# Altium schematic sheet IMU.SchDoc
size A; SheetNumber: 1; SheetTotal: 3
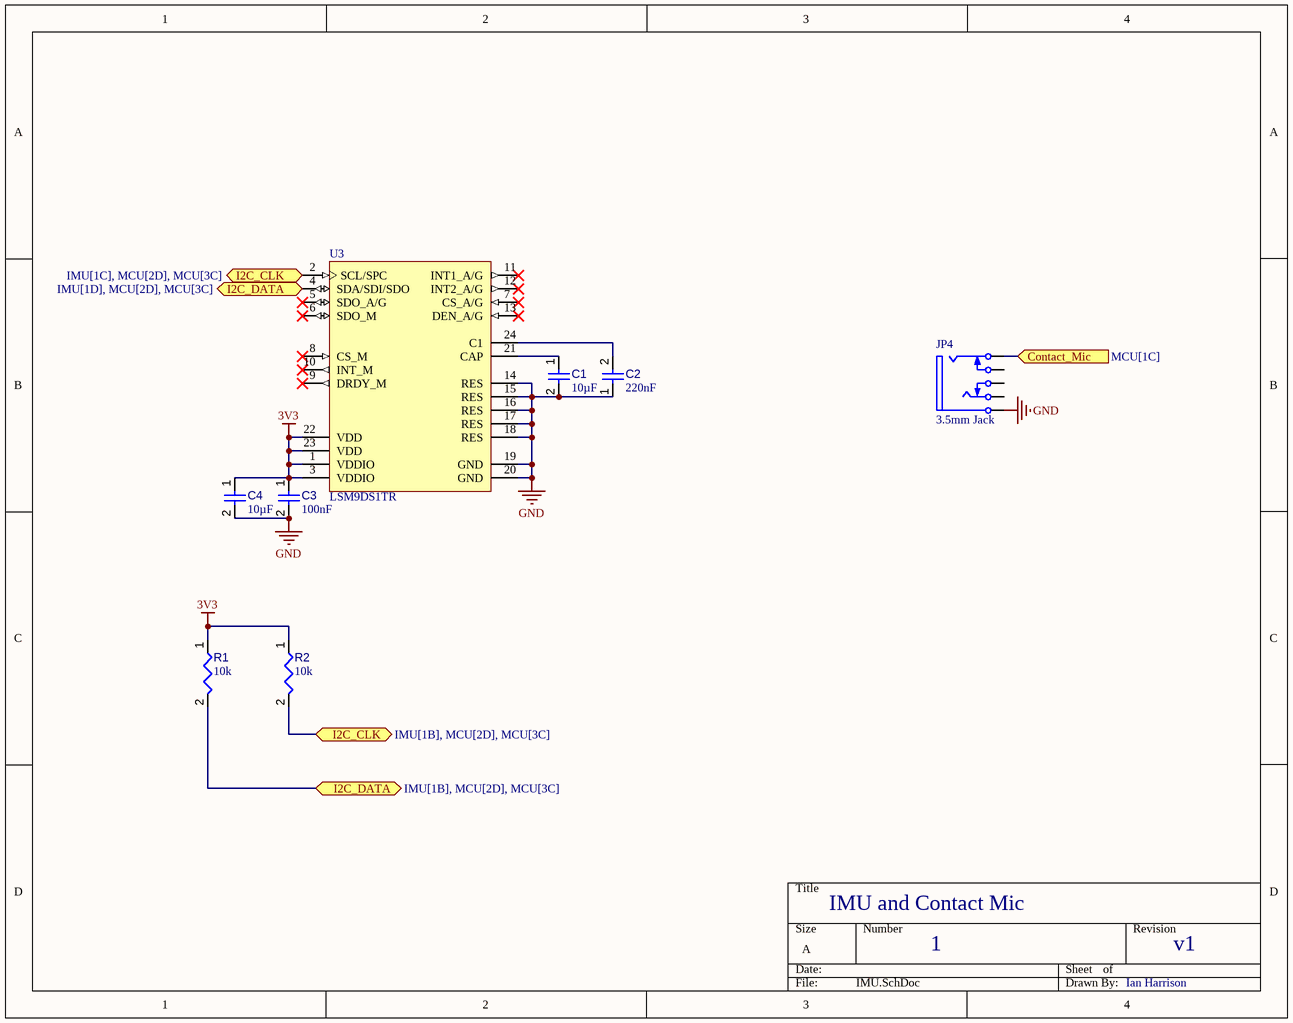
[diagram p0: IMU.SchDoc]

## Parts
C1  value 10µF  [CAPC0603(1608)100_L]  (hidden comment: Capacitor 10µF +/-20% 10V 0603)
C2  value 220nF  [FP-C0603C-CF-IPC_B]  (hidden comment: Capacitor 220 nF)
C3  value 100nF  [CAPC1608X90X40NL10T20]  (hidden comment: Capacitor 100 nF +/-10% 50 V 0603)
C4  value 10µF  [CAPC0603(1608)100_L]  (hidden comment: Capacitor 10µF +/-20% 10V 0603)
JP4  3.5mm Jack  [SWIT-35RASMT4BHNTRX_V]
R1  value 10k  [RESC1608X55X25ML10T15]  (hidden comment: Resistor 10k +/-1% 0603 100 mW)
R2  value 10k  [RESC1608X55X25ML10T15]  (hidden comment: Resistor 10k +/-1% 0603 100 mW)
U3  LSM9DS1TR  [STM-LGA-24_3500X3000X1000]

## Ports
Contact_Mic (in, see MCU[1C]), I2C_CLK (bidir, see IMU[1B], MCU[2D], MCU[3C]), I2C_CLK (bidir, see IMU[1C], MCU[2D], MCU[3C]), I2C_DATA (bidir, see IMU[1B], MCU[2D], MCU[3C]), I2C_DATA (bidir, see IMU[1D], MCU[2D], MCU[3C])

## Nets
3V3: C3.1 C4.1 R1.1 R2.1 U3.1(VDDIO) U3.3(VDDIO) U3.22(VDD) U3.23(VDD)
GND: C1.2 C2.1 C3.2 C4.2 JP4.1 U3.14(RES) U3.15(RES) U3.16(RES) U3.17(RES) U3.18(RES) U3.19(GND) U3.20(GND)
Contact_Mic: JP4.2 ; port Contact_Mic
I2C_CLK: R2.2 U3.2(SCL/SPC) ; port I2C_CLK
I2C_DATA: R1.2 U3.4(SDA/SDI/SDO) ; port I2C_DATA
NetC1_1: C1.1 U3.21(CAP)
NetC2_2: C2.2 U3.24(C1)

Not connected (* = marked no-connect by the designer): JP4 3 4 5; U3 5(SDO_A/G)* 6(SDO_M)* 7(CS_A/G)* 8(CS_M)* 9(DRDY_M)* 10(INT_M)* 11(INT1_A/G)* 12(INT2_A/G)* 13(DEN_A/G)*

## Notes on the sheet
- IMU and Contact Mic
- 1
- v1
- Ian Harrison

## Library data of the parts
C1 C4 = CMP-001-00075-4: Chip Capacitor, 10µF +/-20%, 10V, 0603, Thickness 1 mm; Tolerance: 10%; Voltage Rating: 10V; Max Operating Temperature: 85°C; Pins: 2; Case/Package: 0603; Mounting Technology: SMT; Min Operating Temperature: -55°C
C2 = CMP-001-00085-2: Ceramic Capacitor, Multilayer, Ceramic, 25V, 10% +Tol, 10% -Tol, X7R, 15% TC, 0.22uF, Surface Mount, 0603; Capacitor Type: Ceramic; Min Operating Temperature: -55°C; RoHS Compliant: Yes; Case/Package: 0603; Mounting Technology: Surface Mount; Max Operating Temperature: 125°C; Pins: 2
C3 = CMP-001-00017-7: Chip Capacitor, 100 nF, +/- 10%, 50 V, 0603 (1608 Metric); Voltage Rating: 50V; Capacitor Type: Ceramic; Tolerance: 10%; Mounting Technology: SM; Max Operating Temperature: 125°C; RoHS Compliant: True; Pins: 2; Case/Package: 0603; Min Operating Temperature: -55°C
JP4 = CMP-002-00071-1: 3 Pole(s), Surface Mount Terminal, Jack; Connector Type: AUDIO/RCA CONNECTOR; Mounting Technology: Board; RoHS Compliant: Yes
R1 R2 = CMP-009-00017-5: Chip Resistor, 10 KOhm, +/- 1%, 01 W, -55 to 155 degC, 0603 (1608 Metric); Voltage Rating: 50V; Power: 100mW; RoHS Compliant: True; Min Operating Temperature: -55°C; Pins: 2; Case/Package: 0603; Mounting Technology: SM; Max Operating Temperature: 155°C; Tolerance: 1%
U3 = CMP-2000-06606-1: iNEMO Inertial Module: 3D Accelerometer, 3D Gyroscope, 3D Magnetometer, 1.9 to 3.6 V, -40 to 85 degC, 24-Pin LGA, RoHS, Tape and Reel; Manufacturer: STMicroelectronics; SVHC: NoSVHC(17-Dec-2015); MEMS Module Function: Tri-AxisGyroscope,Tri-AxisAccelerometer,Tri-AxisMagnetometer; Supply Voltage Max: 3.6V; No. of Pins: 24Pins; Gyroscope Range: ±245°/s,±500°/s,±2000°/s; Acceleration Range: ±2g,±4g,±8g,±16g; Supply Voltage Min: 1.9V; Package Description: 24-Pin Plastic Land Grid Array Package, Body 3.65 x 3.15 mm, Pitch 0.43 mm; Manufacturer URL: http://www.st.com/; PartNumber: LSM9DS1; Product Range: -; Packaging: CutTape; Sensor Case Style: LGA; Datasheet URL: http://www2.st.com/content/ccc/resource/technical/document/datasheet/1e/3f/2a/d6/25/eb/48/46/DM00103319.pdf/files/DM00103319.pdf/jcr:content/translations/en.DM00103319.pdf; Package Reference: LGA-24_3500X3000X1000; Mounting Technology: SurfaceMount; Datasheet Version: Rev. 3, 03/2015; MSL: MSL3-168hours